# EasyEDA schematic SCH_Bob Endstops_2022-07-10.json
TITLE: Sheet_1; REV: 1.0; Date: 2022-06-12; Sheet: 1/1; Drawn By: Edward Niedziejko; Company: Your Company
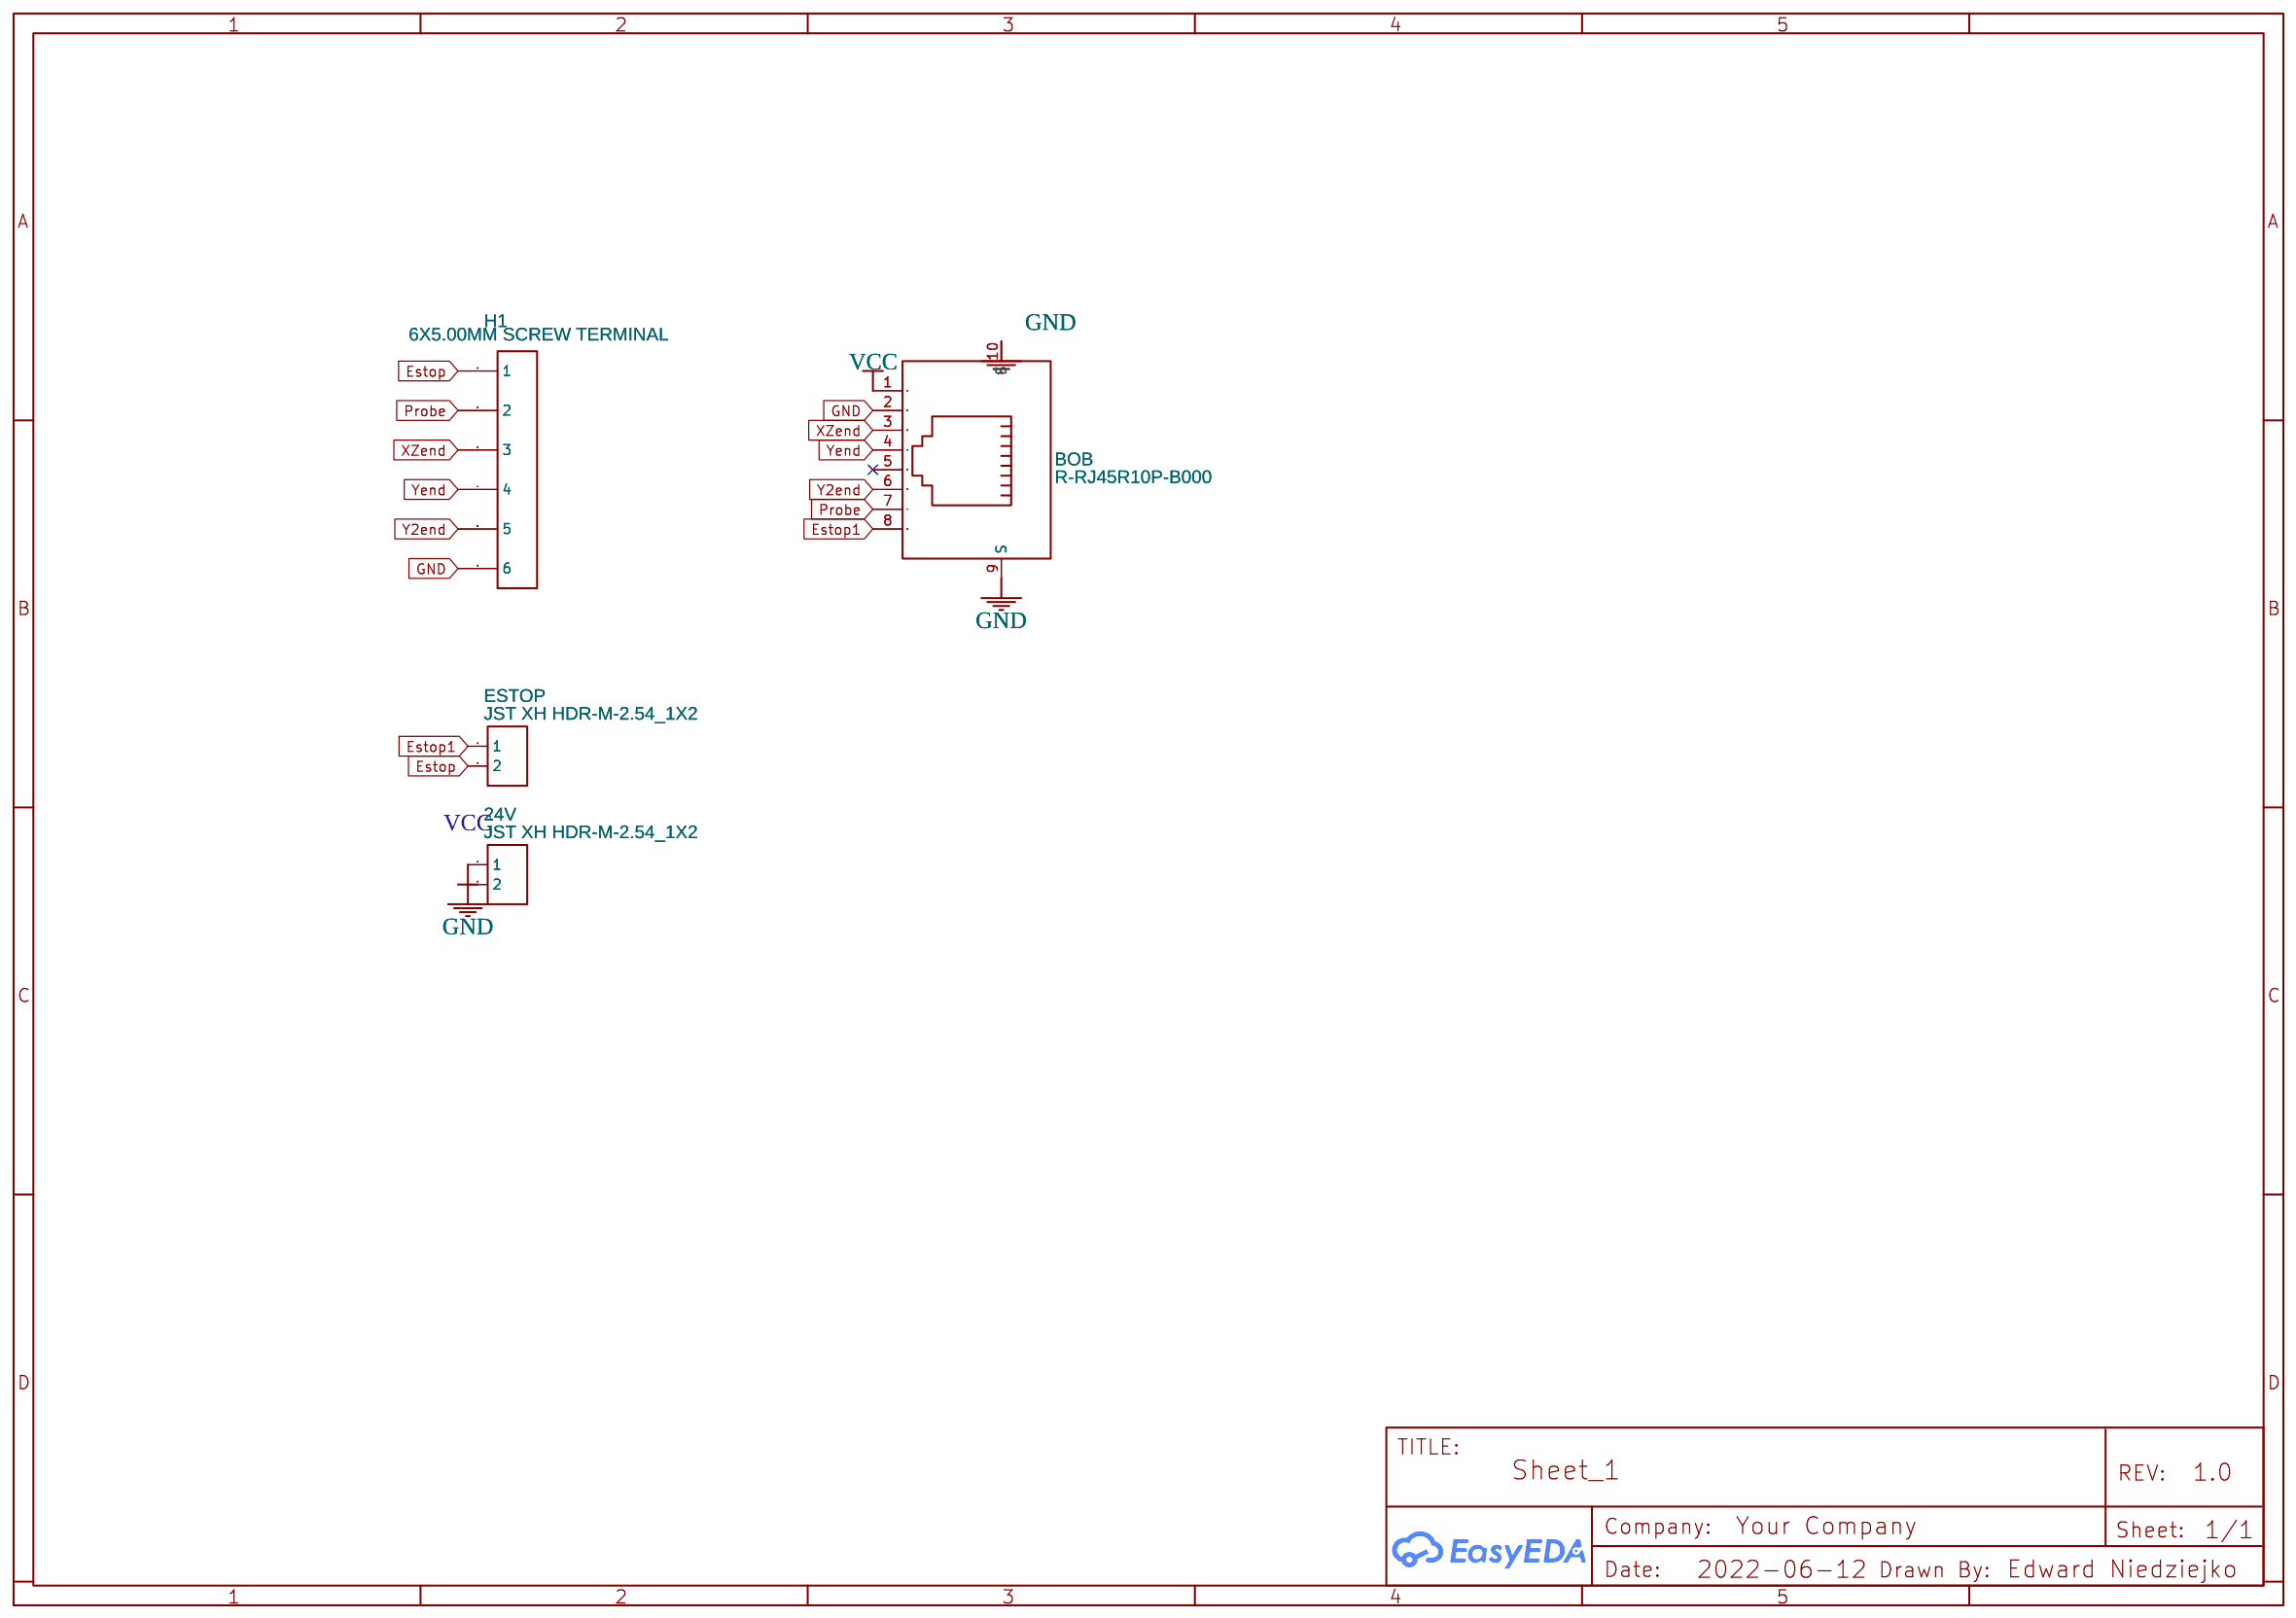
[diagram p0: schematic sheet]

## Parts
24V  JST XH HDR-M-2.54_1X2  [JST-XH-02-PACKAGE-ROUND-PAD]
BOB  R-RJ45R10P-B000  [RJ45-TH_R-RJ45R10P-B000]
ESTOP  JST XH HDR-M-2.54_1X2  [JST-XH-02-PACKAGE-ROUND-PAD]
H1  6X5.00MM SCREW TERMINAL  [6X5.00MM SCREW TERMINAL]

## Library data of the parts
24V ESTOP = JST XH HDR-M-2.54_1X2: Supplier Part: C49661; Supplier: LCSC; Contributor: MAKPOL HAVUZ
BOB = R-RJ45R10P-B000: Supplier: LCSC; Supplier Part: C386758; Manufacturer: Shenzhen Cankemeng; Contributor: LCSC; JLCPCB Part Class: Extended Part
H1 = 6X5.00MM SCREW TERMINAL: Contributor: porkyneal

## Nets
GND: 24V.2 BOB.2 BOB.9(S) BOB.10(S) H1.6
VCC: 24V.1 BOB.1
Estop: ESTOP.2 H1.1
Estop1: BOB.8 ESTOP.1
Probe: BOB.7 H1.2
XZend: BOB.3 H1.3
Y2end: BOB.6 H1.5
Yend: BOB.4 H1.4

Not connected (* = marked no-connect by the designer): BOB 5*
